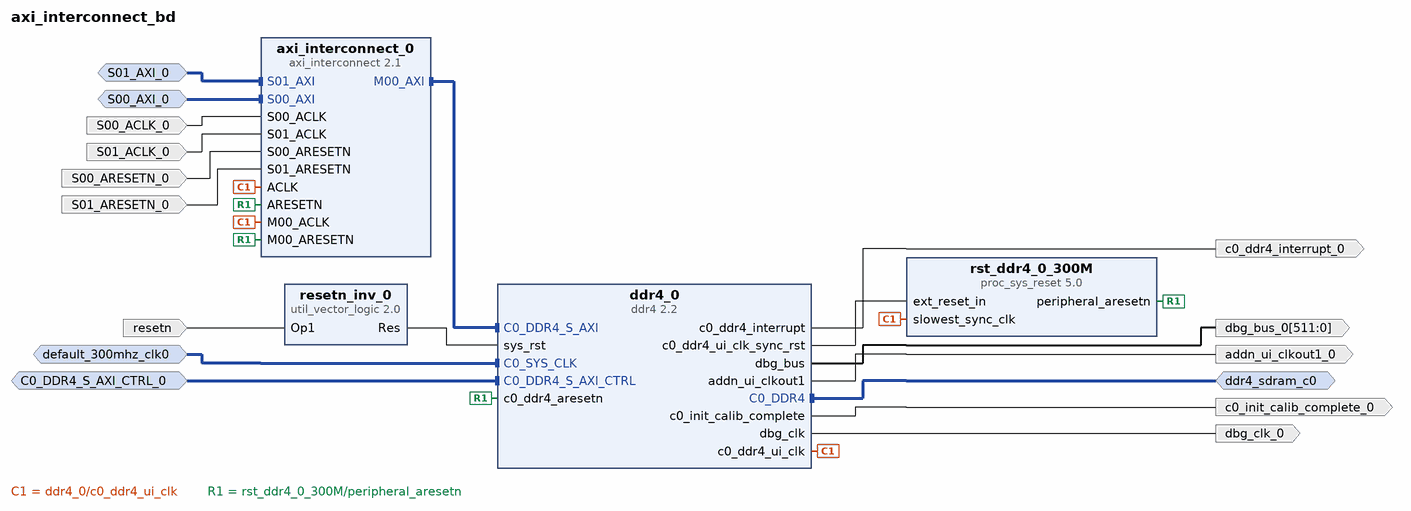
[diagram p0: block diagram of the top level]
# Vivado block design axi_interconnect_bd, xcu250-figd2104-2L-e, Vivado 2019.2.1
create_bd_design axi_interconnect_bd

create_bd_intf_port -mode Master -vlnv xilinx.com:interface:ddr4_rtl:1.0 ddr4_sdram_c0
create_bd_intf_port -mode Slave -vlnv xilinx.com:interface:diff_clock_rtl:1.0 default_300mhz_clk0
set_property -dict {CONFIG.FREQ_HZ 300000000} [get_bd_intf_ports default_300mhz_clk0]
create_bd_intf_port -mode Slave -vlnv xilinx.com:interface:aximm_rtl:1.0 C0_DDR4_S_AXI_CTRL_0
set_property -dict [list \
  CONFIG.DATA_WIDTH 32 \
  CONFIG.PROTOCOL AXI4LITE \
  CONFIG.FREQ_HZ 300000000 \
  CONFIG.ID_WIDTH 0 \
  CONFIG.ADDR_WIDTH 32 \
  CONFIG.AWUSER_WIDTH 0 \
  CONFIG.ARUSER_WIDTH 0 \
  CONFIG.WUSER_WIDTH 0 \
  CONFIG.RUSER_WIDTH 0 \
  CONFIG.BUSER_WIDTH 0 \
  CONFIG.READ_WRITE_MODE READ_WRITE \
  CONFIG.HAS_BURST 0 \
  CONFIG.HAS_LOCK 0 \
  CONFIG.HAS_PROT 0 \
  CONFIG.HAS_CACHE 0 \
  CONFIG.HAS_QOS 0 \
  CONFIG.HAS_REGION 0 \
  CONFIG.HAS_WSTRB 0 \
  CONFIG.HAS_BRESP 1 \
  CONFIG.HAS_RRESP 1 \
  CONFIG.SUPPORTS_NARROW_BURST 0 \
  CONFIG.NUM_READ_OUTSTANDING 1 \
  CONFIG.NUM_WRITE_OUTSTANDING 1 \
  CONFIG.MAX_BURST_LENGTH 1 \
  CONFIG.NUM_READ_THREADS 1 \
  CONFIG.NUM_WRITE_THREADS 1 \
  CONFIG.RUSER_BITS_PER_BYTE 0 \
  CONFIG.WUSER_BITS_PER_BYTE 0 \
] [get_bd_intf_ports C0_DDR4_S_AXI_CTRL_0]
create_bd_intf_port -mode Slave -vlnv xilinx.com:interface:aximm_rtl:1.0 S01_AXI_0
set_property -dict [list \
  CONFIG.DATA_WIDTH 32 \
  CONFIG.PROTOCOL AXI4 \
  CONFIG.ID_WIDTH 1 \
  CONFIG.ADDR_WIDTH 32 \
  CONFIG.AWUSER_WIDTH 0 \
  CONFIG.ARUSER_WIDTH 0 \
  CONFIG.WUSER_WIDTH 0 \
  CONFIG.RUSER_WIDTH 0 \
  CONFIG.BUSER_WIDTH 0 \
  CONFIG.READ_WRITE_MODE READ_WRITE \
  CONFIG.HAS_BURST 1 \
  CONFIG.HAS_LOCK 1 \
  CONFIG.HAS_PROT 1 \
  CONFIG.HAS_CACHE 1 \
  CONFIG.HAS_QOS 1 \
  CONFIG.HAS_REGION 0 \
  CONFIG.HAS_WSTRB 1 \
  CONFIG.HAS_BRESP 1 \
  CONFIG.HAS_RRESP 1 \
  CONFIG.SUPPORTS_NARROW_BURST 1 \
  CONFIG.NUM_READ_OUTSTANDING 2 \
  CONFIG.NUM_WRITE_OUTSTANDING 2 \
  CONFIG.MAX_BURST_LENGTH 256 \
  CONFIG.NUM_READ_THREADS 1 \
  CONFIG.NUM_WRITE_THREADS 1 \
  CONFIG.RUSER_BITS_PER_BYTE 0 \
  CONFIG.WUSER_BITS_PER_BYTE 0 \
] [get_bd_intf_ports S01_AXI_0]
create_bd_intf_port -mode Slave -vlnv xilinx.com:interface:aximm_rtl:1.0 S00_AXI_0
set_property -dict [list \
  CONFIG.DATA_WIDTH 32 \
  CONFIG.PROTOCOL AXI4 \
  CONFIG.ID_WIDTH 1 \
  CONFIG.ADDR_WIDTH 32 \
  CONFIG.AWUSER_WIDTH 0 \
  CONFIG.ARUSER_WIDTH 0 \
  CONFIG.WUSER_WIDTH 0 \
  CONFIG.RUSER_WIDTH 0 \
  CONFIG.BUSER_WIDTH 0 \
  CONFIG.READ_WRITE_MODE READ_WRITE \
  CONFIG.HAS_BURST 1 \
  CONFIG.HAS_LOCK 1 \
  CONFIG.HAS_PROT 1 \
  CONFIG.HAS_CACHE 1 \
  CONFIG.HAS_QOS 1 \
  CONFIG.HAS_REGION 0 \
  CONFIG.HAS_WSTRB 1 \
  CONFIG.HAS_BRESP 1 \
  CONFIG.HAS_RRESP 1 \
  CONFIG.SUPPORTS_NARROW_BURST 1 \
  CONFIG.NUM_READ_OUTSTANDING 2 \
  CONFIG.NUM_WRITE_OUTSTANDING 2 \
  CONFIG.MAX_BURST_LENGTH 256 \
  CONFIG.NUM_READ_THREADS 1 \
  CONFIG.NUM_WRITE_THREADS 1 \
  CONFIG.RUSER_BITS_PER_BYTE 0 \
  CONFIG.WUSER_BITS_PER_BYTE 0 \
] [get_bd_intf_ports S00_AXI_0]
create_bd_port -dir I -type rst resetn
set_property -dict {CONFIG.POLARITY ACTIVE_LOW} [get_bd_ports resetn]
create_bd_port -dir I -type clk S00_ACLK_0
create_bd_port -dir I -type clk S01_ACLK_0
create_bd_port -dir I -type rst S00_ARESETN_0
create_bd_port -dir I -type rst S01_ARESETN_0
create_bd_port -dir O c0_ddr4_interrupt_0
create_bd_port -dir O -from 511 -to 0 dbg_bus_0
create_bd_port -dir O dbg_clk_0
create_bd_port -dir O c0_init_calib_complete_0
create_bd_port -dir O -type clk addn_ui_clkout1_0

create_bd_cell -type ip -vlnv xilinx.com:ip:axi_interconnect:2.1 axi_interconnect_0
set_property -dict {CONFIG.NUM_MI 1 CONFIG.NUM_SI 2} [get_bd_cells axi_interconnect_0]
create_bd_cell -type ip -vlnv xilinx.com:ip:ddr4:2.2 ddr4_0
set_property -dict [list \
  CONFIG.C0_CLOCK_BOARD_INTERFACE default_300mhz_clk0 \
  CONFIG.C0_DDR4_BOARD_INTERFACE ddr4_sdram_c0 \
  CONFIG.RESET_BOARD_INTERFACE resetn \
] [get_bd_cells ddr4_0]
create_bd_cell -type ip -vlnv xilinx.com:ip:util_vector_logic:2.0 resetn_inv_0
set_property -dict {CONFIG.C_OPERATION not CONFIG.C_SIZE 1} [get_bd_cells resetn_inv_0]
create_bd_cell -type ip -vlnv xilinx.com:ip:proc_sys_reset:5.0 rst_ddr4_0_300M

# ---- connections ----

connect_bd_intf_net -intf_net default_300mhz_clk0_1 [get_bd_intf_ports default_300mhz_clk0] [get_bd_intf_pins ddr4_0/C0_SYS_CLK]
connect_bd_intf_net [get_bd_intf_ports ddr4_sdram_c0] [get_bd_intf_pins ddr4_0/C0_DDR4]
connect_bd_intf_net [get_bd_intf_pins axi_interconnect_0/M00_AXI] [get_bd_intf_pins ddr4_0/C0_DDR4_S_AXI]
connect_bd_intf_net -intf_net S01_AXI_0_1 [get_bd_intf_ports S01_AXI_0] [get_bd_intf_pins axi_interconnect_0/S01_AXI]
connect_bd_intf_net -intf_net S00_AXI_0_1 [get_bd_intf_ports S00_AXI_0] [get_bd_intf_pins axi_interconnect_0/S00_AXI]
connect_bd_intf_net -intf_net C0_DDR4_S_AXI_CTRL_0_1 [get_bd_intf_ports C0_DDR4_S_AXI_CTRL_0] [get_bd_intf_pins ddr4_0/C0_DDR4_S_AXI_CTRL]
connect_bd_net [get_bd_pins resetn_inv_0/Res] [get_bd_pins ddr4_0/sys_rst]
connect_bd_net [get_bd_pins ddr4_0/c0_ddr4_ui_clk] \
  [get_bd_pins axi_interconnect_0/ACLK] [get_bd_pins rst_ddr4_0_300M/slowest_sync_clk] \
  [get_bd_pins axi_interconnect_0/M00_ACLK]
connect_bd_net [get_bd_pins ddr4_0/c0_ddr4_ui_clk_sync_rst] [get_bd_pins rst_ddr4_0_300M/ext_reset_in]
connect_bd_net [get_bd_pins rst_ddr4_0_300M/peripheral_aresetn] \
  [get_bd_pins axi_interconnect_0/ARESETN] [get_bd_pins axi_interconnect_0/M00_ARESETN] [get_bd_pins ddr4_0/c0_ddr4_aresetn]
connect_bd_net -net S00_ACLK_0_1 [get_bd_ports S00_ACLK_0] [get_bd_pins axi_interconnect_0/S00_ACLK]
connect_bd_net -net S01_ACLK_0_1 [get_bd_ports S01_ACLK_0] [get_bd_pins axi_interconnect_0/S01_ACLK]
connect_bd_net -net S00_ARESETN_0_1 [get_bd_ports S00_ARESETN_0] [get_bd_pins axi_interconnect_0/S00_ARESETN]
connect_bd_net -net S01_ARESETN_0_1 [get_bd_ports S01_ARESETN_0] [get_bd_pins axi_interconnect_0/S01_ARESETN]
connect_bd_net [get_bd_ports resetn] [get_bd_pins resetn_inv_0/Op1]
connect_bd_net [get_bd_pins ddr4_0/c0_ddr4_interrupt] [get_bd_ports c0_ddr4_interrupt_0]
connect_bd_net [get_bd_pins ddr4_0/dbg_bus] [get_bd_ports dbg_bus_0]
connect_bd_net [get_bd_pins ddr4_0/dbg_clk] [get_bd_ports dbg_clk_0]
connect_bd_net [get_bd_pins ddr4_0/c0_init_calib_complete] [get_bd_ports c0_init_calib_complete_0]
connect_bd_net [get_bd_pins ddr4_0/addn_ui_clkout1] [get_bd_ports addn_ui_clkout1_0]

# ---- address map ----
exclude_bd_addr_seg -offset 0x80000000 -range 1M -target_address_space [get_bd_addr_spaces C0_DDR4_S_AXI_CTRL_0] [get_bd_addr_segs ddr4_0/C0_DDR4_MEMORY_MAP_CTRL/C0_REG]
assign_bd_address -offset 0x00000000 -range 4G -target_address_space [get_bd_addr_spaces S00_AXI_0] [get_bd_addr_segs ddr4_0/C0_DDR4_MEMORY_MAP/C0_DDR4_ADDRESS_BLOCK]
assign_bd_address -offset 0x00000000 -range 4G -target_address_space [get_bd_addr_spaces S01_AXI_0] [get_bd_addr_segs ddr4_0/C0_DDR4_MEMORY_MAP/C0_DDR4_ADDRESS_BLOCK]

validate_bd_design
save_bd_design
